# Altium schematic sheet ScoreDisplay_1.SchDoc: Score Display 1
size A4
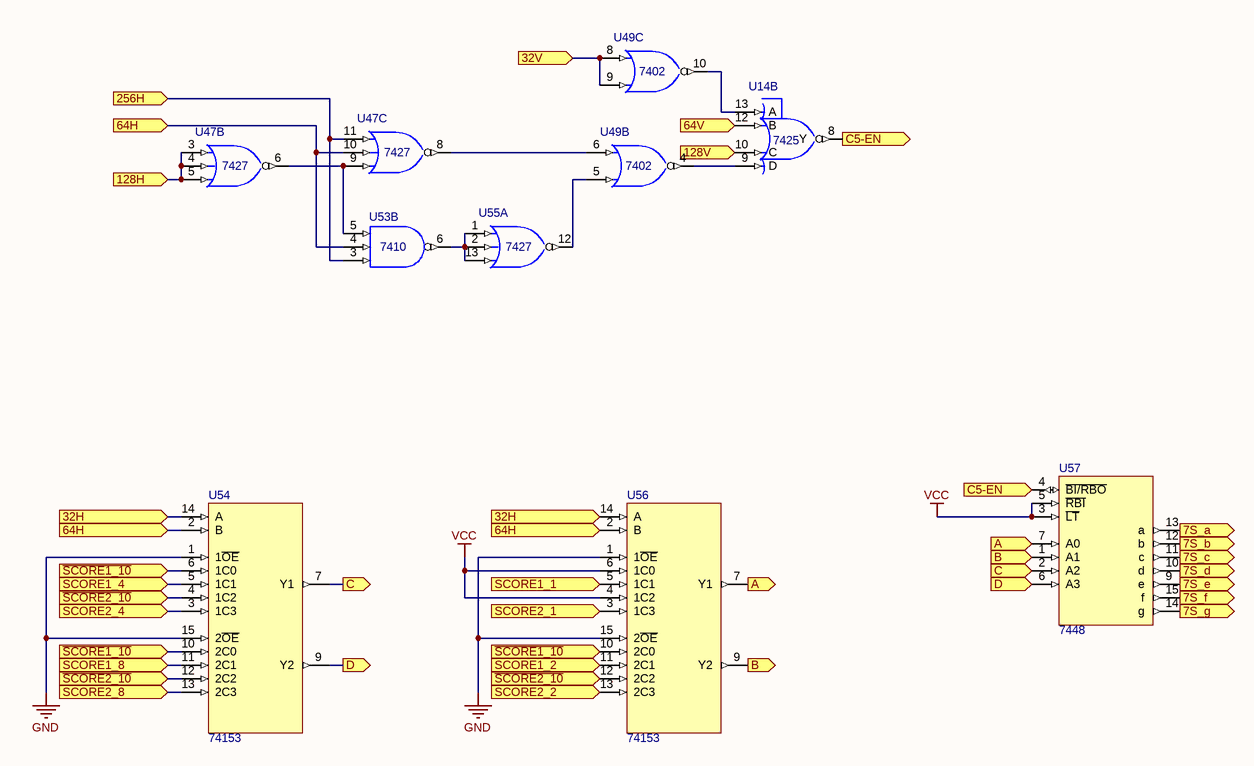
[diagram p0: ScoreDisplay_1.SchDoc]

## Parts
U14  7425  [N014]  (part B of 2)
U47  7427  [N014]  (parts B,C of 3)
U49  7402  [N014]  (parts B,C of 4)
U53  7410  [N014]  (part B of 3)
U54  74153  [N016]
U55  7427  [N014]  (part A of 3)
U56  74153  [N016]
U57  7448  [N016D]

## Ports
7S_a, 7S_b, 7S_c, 7S_d, 7S_e, 7S_f, 7S_g, 32H, 32V, 64H, 64V, 128H, 128V, 256H, A, B, C, C5-EN, D, SCORE1_1, SCORE1_2, SCORE1_4, SCORE1_8, SCORE2_1, SCORE2_2, SCORE2_4, SCORE2_8, ~{SCORE1_10}, ~{SCORE2_10}

## Nets
GND: U14.7(GND) U47.7(GND) U49.7(GND) U53.7(GND) U54.1(1~{OE}) U54.8(GND) U54.15(2~{OE}) U55.7(GND) U56.1(1~{OE}) U56.8(GND) U56.15(2~{OE}) U57.8(GND)
VCC: U14.11(G) U14.14(VCC) U47.14(VCC) U49.14(VCC) U53.14(VCC) U54.16(VCC) U55.14(VCC) U56.4(1C2) U56.6(1C0) U56.16(VCC) U57.3(~{LT}) U57.5(~{RBI}) U57.16(VCC)
7S_a: U57.13(a) ; port 7S_a
7S_b: U57.12(b) ; port 7S_b
7S_c: U57.11(c) ; port 7S_c
7S_d: U57.10(d) ; port 7S_d
7S_e: U57.9(e) ; port 7S_e
7S_f: U57.15(f) ; port 7S_f
7S_g: U57.14(g) ; port 7S_g
32H: U54.14(A) U56.14(A) ; port 32H
32V: U49.8(A) U49.9(B) ; port 32V
64H: U47.10(B) U53.4(B) U54.2(B) U56.2(B) ; port 64H
64V: U14.12(B) ; port 64V
128H: U47.3(A) U47.4(B) U47.5(C) ; port 128H
128V: U14.10(C) ; port 128V
256H: U47.11(C) U53.3(A) ; port 256H
~{SCORE1_10}: U54.6(1C0) U54.10(2C0) U56.10(2C0) ; port ~{SCORE1_10}
~{SCORE2_10}: U54.4(1C2) U54.12(2C2) U56.12(2C2) ; port ~{SCORE2_10}
A: U56.7(Y1) U57.7(A0) ; port A
B: U56.9(Y2) U57.1(A1) ; port B
C: U54.7(Y1) U57.2(A2) ; port C
C5-EN: U14.8(Y) U57.4(~{BI/RBO}) ; port C5-EN
D: U54.9(Y2) U57.6(A3) ; port D
SCORE1_1: U56.5(1C1) ; port SCORE1_1
SCORE1_2: U56.11(2C1) ; port SCORE1_2
SCORE1_4: U54.5(1C1) ; port SCORE1_4
SCORE1_8: U54.11(2C1) ; port SCORE1_8
SCORE2_1: U56.3(1C3) ; port SCORE2_1
SCORE2_2: U56.13(2C3) ; port SCORE2_2
SCORE2_4: U54.3(1C3) ; port SCORE2_4
SCORE2_8: U54.13(2C3) ; port SCORE2_8
NetU14_9: U14.9(D) U49.4(Y)
NetU14_13: U14.13(A) U49.10(Y)
NetU47_6: U47.6(Y) U47.9(A) U53.5(C)
NetU47_8: U47.8(Y) U49.6(B)
NetU49_5: U49.5(A) U55.12(Y)
NetU53_6: U53.6(Y) U55.1(A) U55.2(B) U55.13(C)

## Notes on the sheet
- Text
- Page
- PONG

## Library data of the parts
U14 = SN7425N: Dual 4-Input NOR Gate with Strobe; Published: 8-Jun-2000; LatestRevisionDate: 04-Mar-2005; LatestRevisionNote: Stylized 3D Model Added.; DatasheetVersion: Mar-1988; PackageVersion: Oct-1995; PackageReference: N014; Publisher: Altium Limited; PackageDescription: DIP; 14 Leads; Row Spacing 7.62 mm; Pitch 2.54 mm; ComponentLink1Description: Manufacturer Link; ComponentLink1URL: http://www.ti.com/; ComponentLink2Description: Datasheet; ComponentLink2URL: http://www-s.ti.com/sc/ds/sn5425.pdf; ComponentLink3Description: Packaging Specification; ComponentLink3URL: http://focus.ti.com/lit/ml/mpdi002c/mpdi002c.pdf
U47 U55 = SN74LS27N: Triple 3-Input Positive-NOR Gate; Published: 8-Jun-2000; LatestRevisionDate: 04-Mar-2005; LatestRevisionNote: Stylized 3D Model Added.; DatasheetVersion: Mar-1988; PackageVersion: Oct-1995; PackageReference: N014; Publisher: Altium Limited; PackageDescription: DIP; 14 Leads; Row Spacing 7.62 mm; Pitch 2.54 mm; ComponentLink1Description: Manufacturer Link; ComponentLink1URL: http://www.ti.com/; ComponentLink2Description: Datasheet; ComponentLink2URL: http://www-s.ti.com/sc/ds/sn74ls27.pdf
U49 = SN74LS02N: Quadruple 2-Input Positive-NOR Gate; Published: 8-Jun-2000; LatestRevisionDate: 04-Mar-2005; LatestRevisionNote: Stylized 3D Model Added.; DatasheetVersion: Mar-1988; PackageVersion: Oct-1995; PackageReference: N014; Publisher: Altium Limited; PackageDescription: DIP; 14 Leads; Row Spacing 7.62 mm; Pitch 2.54 mm; ComponentLink1Description: Manufacturer Link; ComponentLink1URL: http://www.ti.com/; ComponentLink2Description: Datasheet; ComponentLink2URL: http://www-s.ti.com/sc/ds/sn54s02.pdf
U53 = SN74LS10N: Triple 3-Input Positive-NAND Gate; Published: 8-Jun-2000; LatestRevisionDate: 04-Mar-2005; LatestRevisionNote: Stylized 3D Model Added.; DatasheetVersion: Mar-1988; PackageVersion: Oct-1995; PackageReference: N014; Publisher: Altium Limited; PackageDescription: DIP; 14 Leads; Row Spacing 7.62 mm; Pitch 2.54 mm; ComponentLink1Description: Manufacturer Link; ComponentLink1URL: http://www.ti.com/; ComponentLink2Description: Datasheet; ComponentLink2URL: http://www-s.ti.com/sc/ds/sn74ls10.pdf
U54 U56 = SN74LS153N: Dual 4-Line to 1-Line Data Selector/Multiplexer; Published: 8-Jun-2000; LatestRevisionDate: 04-Mar-2005; LatestRevisionNote: Stylized 3D Model Added.; DatasheetVersion: Mar-1988; PackageVersion: Oct-1995; PackageReference: N016; Publisher: Altium Limited; PackageDescription: DIP; 16 Leads; Row Spacing 7.62 mm; Pitch 2.54 mm; Code_JEDEC: MS-001-BB; ComponentLink1Description: Manufacturer Link; ComponentLink1URL: http://www.ti.com/; ComponentLink2Description: Datasheet; ComponentLink2URL: http://www-s.ti.com/sc/ds/sn74ls153.pdf
U57 = SN74LS48N: BCD-to-Seven-Segment Decoder/Driver; Published: 8-Jun-2000; LatestRevisionDate: 29-May-2009; LatestRevisionNote: Component Body Added.; DatasheetVersion: Mar-1988; PackageVersion: Oct-1995; PackageReference: N016D; Publisher: Altium Limited; PackageDescription: DIP, 16-Pin, Row Spacing 7.62 mm, Pitch 2.54 mm; Code_JEDEC: MS-001-BB; ComponentLink1Description: Manufacturer Link; ComponentLink1URL: http://www.ti.com/